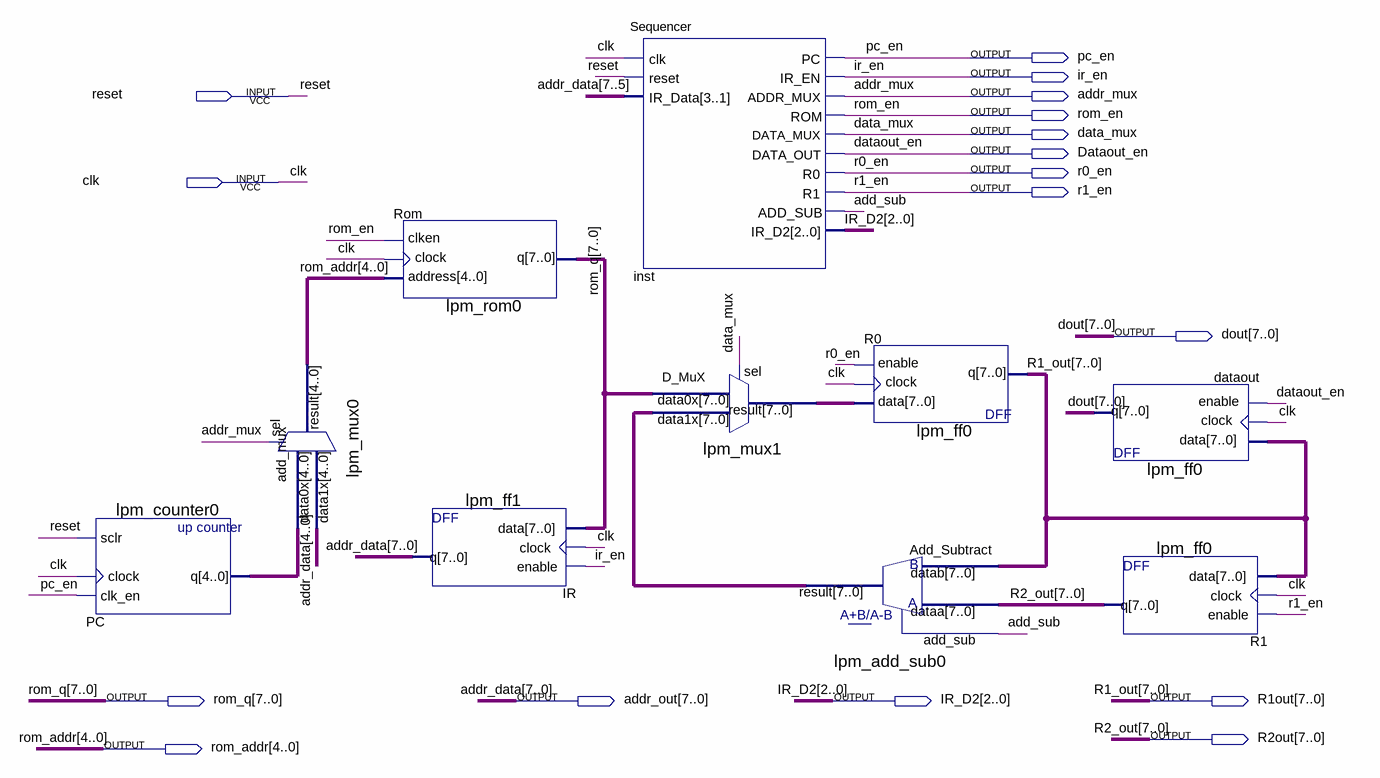
[diagram p0: schematic sheet]
// Quartus schematic Processor.bdf as structural Verilog: 10 symbols, 17 pins
module Processor (
  input  reset,
  input  clk,
  output pc_en,
  output ir_en,
  output addr_mux,
  output rom_en,
  output data_mux,
  output Dataout_en,
  output r0_en,
  output r1_en,
  output [7:0] dout,
  output [7:0] rom_q,
  output [7:0] addr_out,
  output [2:0] IR_D2,
  output [7:0] R1out,
  output [7:0] R2out,
  output [4:0] rom_addr
);

  wire add_sub;
  wire [4:0] PC_q;
  wire [7:0] Add_Subtract_result, D_MuX_result;

  lpm_counter0 PC (.sclr(reset), .clock(clk), .clk_en(pc_en), .q(PC_q));
  lpm_mux0 add_mux (.data1x(addr_out[4:0]), .data0x(PC_q), .sel(addr_mux), .result(rom_addr));
  lpm_rom0 Rom (.address(rom_addr), .clock(clk), .clken(rom_en), .q(rom_q));
  lpm_ff1 IR (.data(rom_q), .clock(clk), .enable(ir_en), .q(addr_out));
  Sequencer inst (
    .clk(clk), .reset(reset), .IR_Data(addr_out[7:5]), .PC(pc_en), .IR_EN(ir_en), .ADDR_MUX(addr_mux),
    .ROM(rom_en), .DATA_MUX(data_mux), .DATA_OUT(Dataout_en), .R0(r0_en), .R1(r1_en), .ADD_SUB(add_sub),
    .IR_D2(IR_D2));
  lpm_mux1 D_MuX (.data1x(Add_Subtract_result), .data0x(rom_q), .sel(data_mux), .result(D_MuX_result));
  lpm_add_sub0 Add_Subtract (.dataa(R2out), .datab(R1out), .add_sub(add_sub), .result(Add_Subtract_result));
  lpm_ff0 R0 (.data(D_MuX_result), .clock(clk), .enable(r0_en), .q(R1out));
  lpm_ff0 dataout (.data(R1out), .clock(clk), .enable(Dataout_en), .q(dout));
  lpm_ff0 R1 (.data(R1out), .clock(clk), .enable(r1_en), .q(R2out));

  // Other names for the same wires on the sheet: addr_data[7:0] = addr_out; R1_out[7:0] = R1out; R2_out[7:0] = R2out
endmodule
